# EAGLE design Shield (EAGLE 7.5.0)
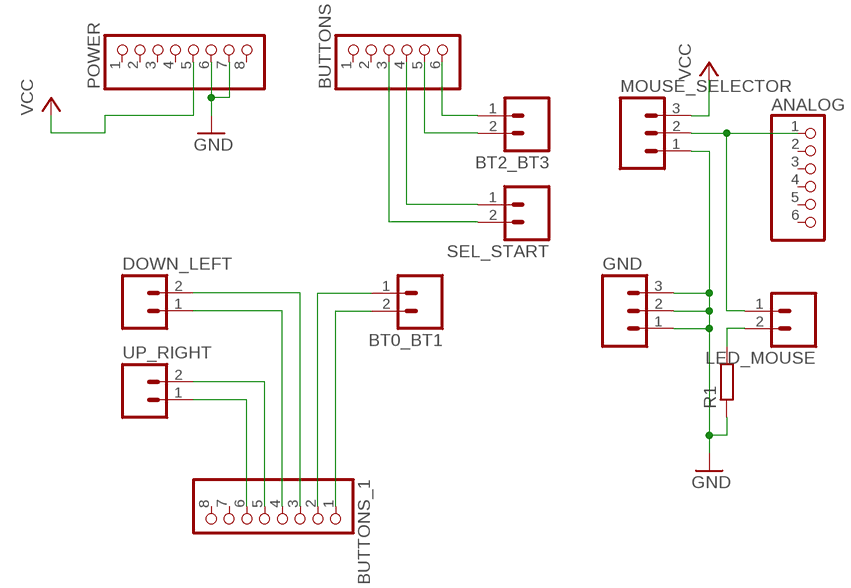
[diagram p0: schematic, sheet 1]

## Parts
ANALOG  PINHD-1X6  [1X06]
BT0_BT1  M023.5MM  [SCREWTERMINAL-3.5MM-2]
BT2_BT3  M023.5MM  [SCREWTERMINAL-3.5MM-2]
BUTTONS  PINHD-1X6  [1X06]
BUTTONS_1  PINHD-1X8BIG  [1X08-BIG]
DOWN_LEFT  M023.5MM  [SCREWTERMINAL-3.5MM-2]
GND  M03SCREW  [SCREWTERMINAL-3.5MM-3]
LED_MOUSE  M023.5MM  [SCREWTERMINAL-3.5MM-2]
MOUSE_SELECTOR  M03SCREW  [SCREWTERMINAL-3.5MM-3]
POWER  PINHD-1X8BIG  [1X08-BIG]
R1  R-EU_0204/7  [0204/7]
SEL_START  M023.5MM  [SCREWTERMINAL-3.5MM-2]
UP_RIGHT  M023.5MM  [SCREWTERMINAL-3.5MM-2]

## Nets
GND: GND.1 GND.2 GND.3 MOUSE_SELECTOR.1 POWER.6 POWER.7 R1.1
N$1: BT0_BT1.2 BUTTONS_1.1
N$2: BT0_BT1.1 BUTTONS_1.2
N$3: BUTTONS_1.3 DOWN_LEFT.2
N$4: BUTTONS_1.4 DOWN_LEFT.1
N$5: BUTTONS_1.5 UP_RIGHT.2
N$6: BUTTONS_1.6 UP_RIGHT.1
N$7: BT2_BT3.1 BUTTONS.6
N$8: BT2_BT3.2 BUTTONS.5
N$9: BUTTONS.4 SEL_START.1
N$10: BUTTONS.3 SEL_START.2
N$12: ANALOG.1 LED_MOUSE.1 MOUSE_SELECTOR.2
N$13: LED_MOUSE.2 R1.2
VCC: MOUSE_SELECTOR.3 POWER.5
Unconnected: ANALOG.2 ANALOG.3 ANALOG.4 ANALOG.5 ANALOG.6 BUTTONS.1 BUTTONS.2 BUTTONS_1.7 BUTTONS_1.8 POWER.1 POWER.2 POWER.3 POWER.4 POWER.8

## Library data of the parts
ANALOG BUTTONS = adafruit:PINHD-1X6: PIN HEADER
BT0_BT1 BT2_BT3 DOWN_LEFT LED_MOUSE SEL_START UP_RIGHT = SparkFun-Connectors:M02: Standard 2-pin 0.1" header. Use with - straight break away headers ( PRT-00116) - right angle break away headers (PRT-00553) - swiss pins (PRT-00743) - machine pins (PRT-00117) - female headers (PRT-00115) Molex polarized connector foot print use with: PRT-08233 with associated crimp pins and housings. 2.54_SCREWTERM for use with PRT-10571. 3.5mm Screw Terminal footprints for PRT-08084 5mm Screw Terminal footprints for use with PRT-08432; PROD_ID: CONN-08399
BUTTONS_1 POWER = adafruit:PINHD-1X8: PIN HEADER
GND MOUSE_SELECTOR = SparkFun-Connectors:M03: Header 3 Standard 3-pin 0.1" header. Use with straight break away headers (SKU : PRT-00116), right angle break away headers (PRT-00553), swiss pins (PRT-00743), machine pins (PRT-00117), and female headers (PRT-00115). Molex polarized connector foot print use with SKU : PRT-08232 with associated crimp pins and housings.; PROD_ID: CONN-08288
R1 = rcl:R-EU_: RESISTOR, European symbol

## Board
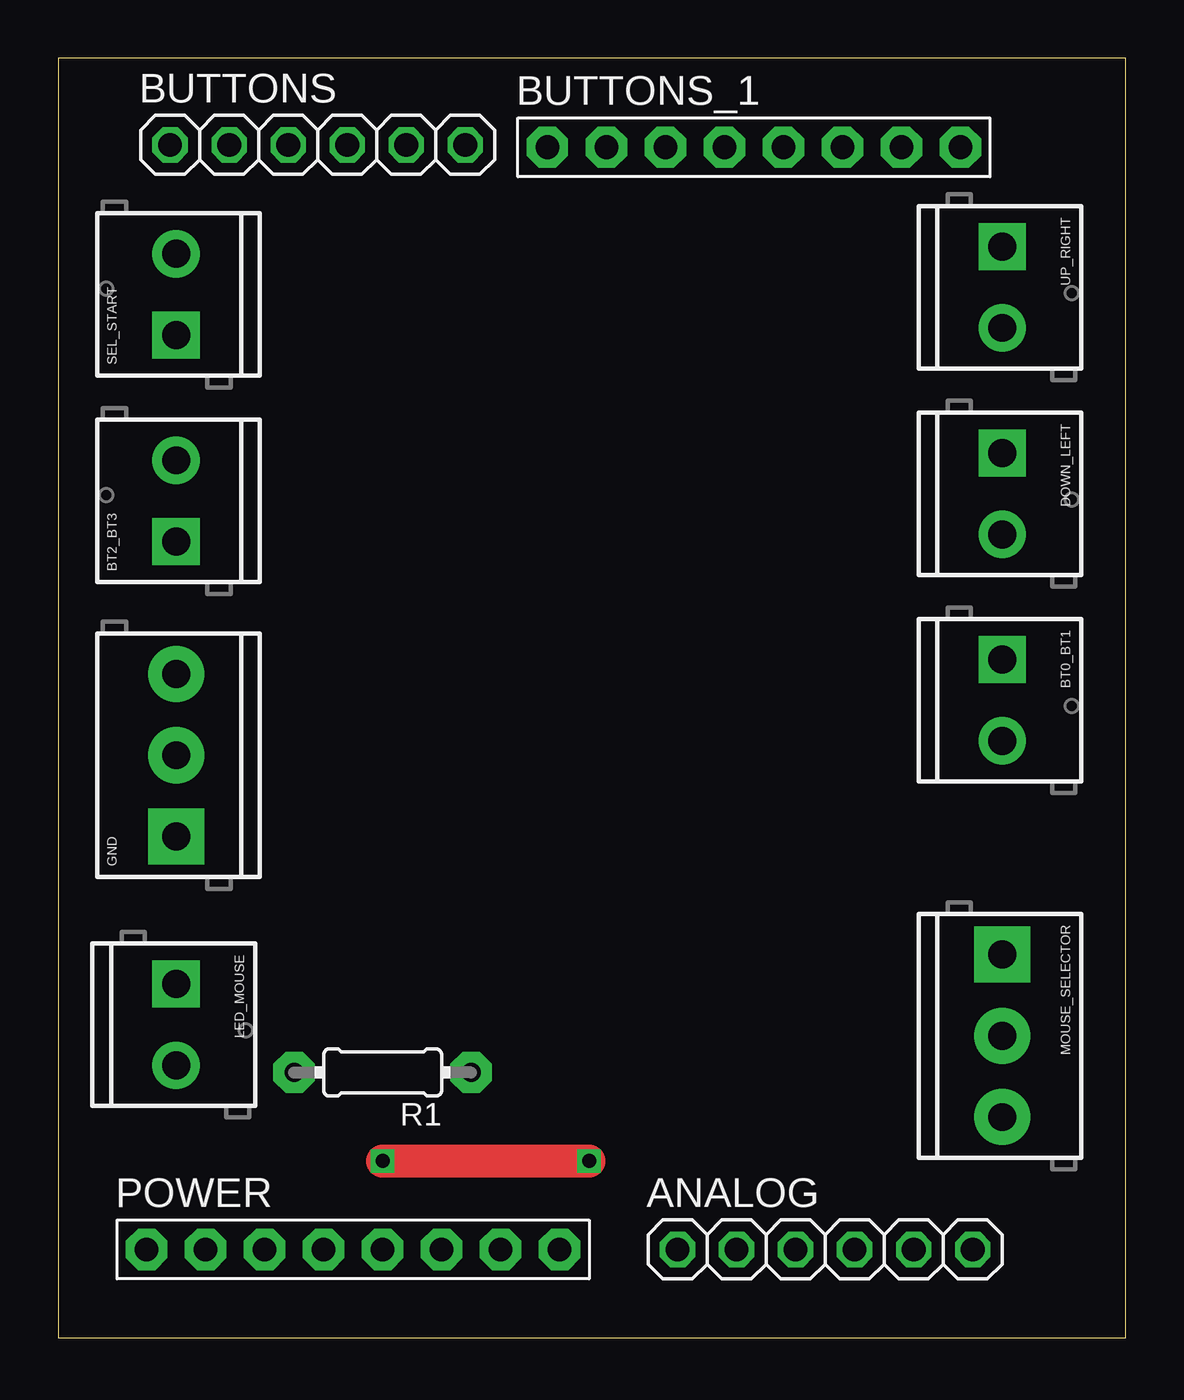
[diagram p1: board, top side]
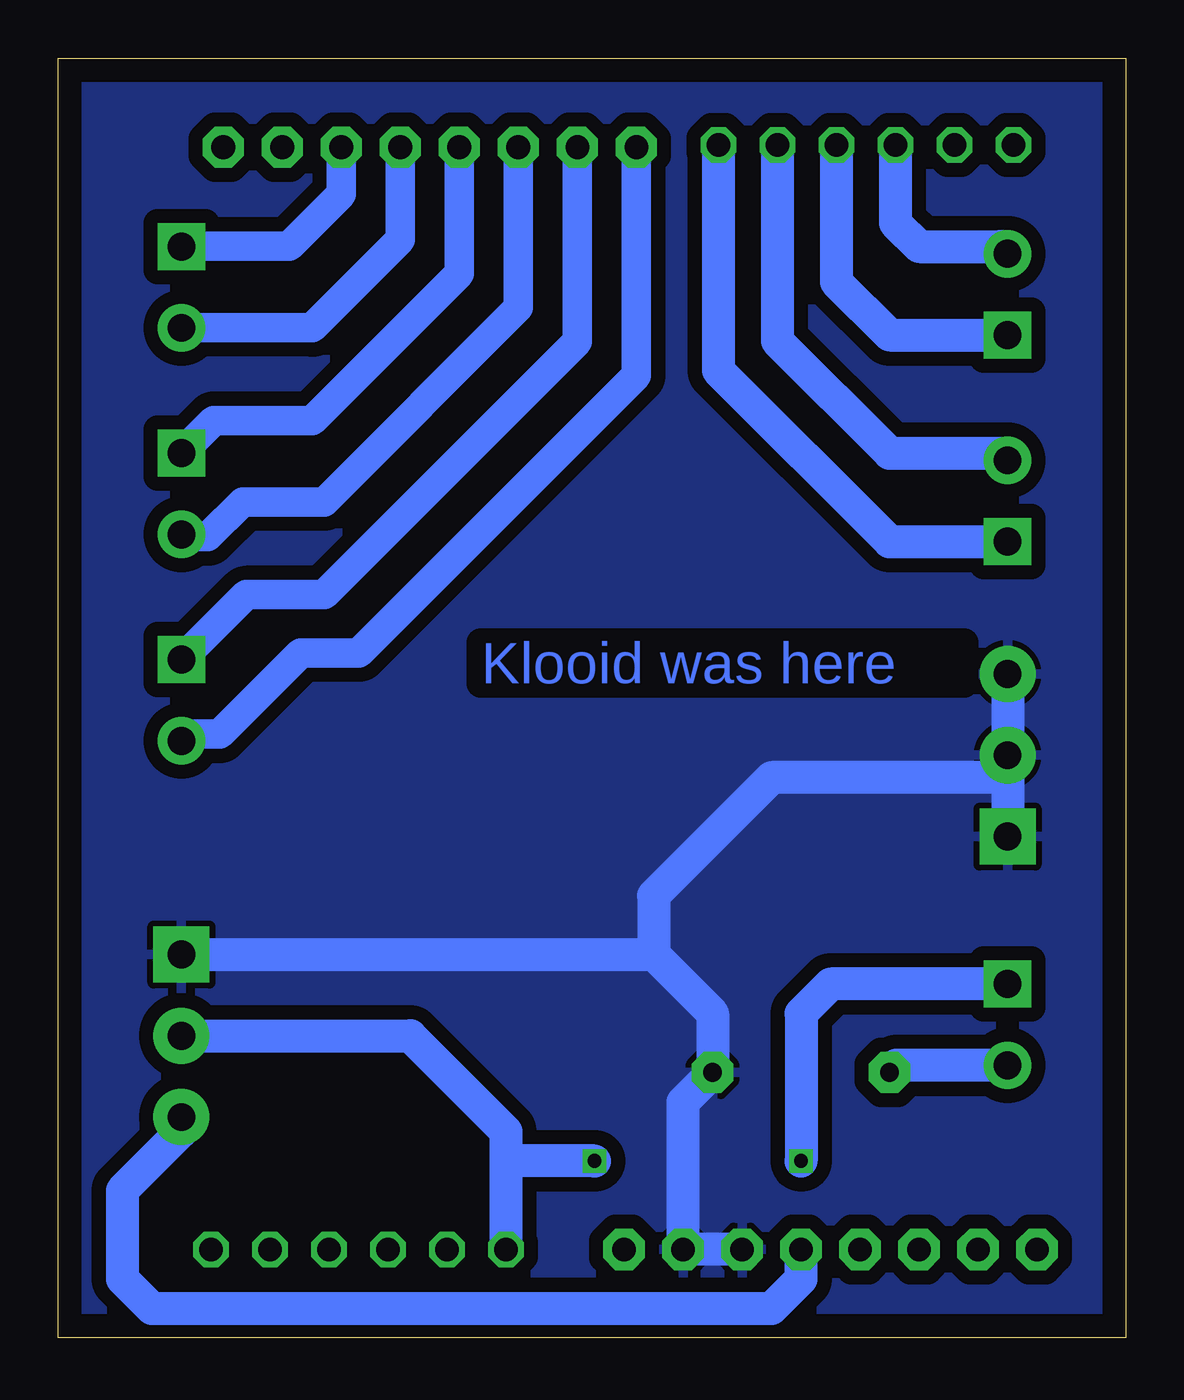
[diagram p2: board, bottom side, seen from below]

Size 45.95 x 55.11 mm. Coordinates in mm from the lower left corner, seen from the top.
Outline: 0,0 45.95,0 45.95,55.11 0,55.11 0,0
Copper layers (1*16): Top 0.035mm / dielectric 1.5mm / Bottom 0.035mm
Design rules "default": minimum track width 10mil, minimum drill 24mil, track to track 8mil, track to pad 8mil, pad to pad 8mil, via to via 8mil, smd to smd 8mil, copper to edge 40mil, drill to drill 8mil, minimum pad ring 10mil, minimum via ring 8mil, stop-mask expansion 4mil, vias tented up to drill 0mil, thermal gap 10mil

### Footprints (pad centres in the part's own frame; a part is rotated, then mirrored left to right if it is on the bottom)
1X06 = drill 1.016 octagon: 1 -6.35,0; 2 -3.81,0; 3 -1.27,0; 4 1.27,0; 5 3.81,0; 6 6.35,0
SCREWTERMINAL-3.5MM-2 = drill 1.2 pad 2.032 square: 1 0,0 | drill 1.2 pad 2.032: 2 3.5,0
1X08-BIG = drill 1.016 pad 1.778 octagon: 1 -8.89,0; 2 -6.35,0; 3 -3.81,0; 4 -1.27,0; 5 1.27,0; 6 3.81,0; 7 6.35,0; 8 8.89,0
SCREWTERMINAL-3.5MM-3 = drill 1.2 pad 2.413 square: 1 0,0 | drill 1.2 pad 2.413: 2 3.5,0; 3 7,0
0204/7 = drill 0.813 pad 1.778 octagon: 1 -3.81,0; 2 3.81,0

### Placement (x,y rotation side)
ANALOG  33.02,3.81 0 top
BT0_BT1  40.64,29.21 270 top
BT2_BT3  5.08,34.29 90 top
BUTTONS  11.18,51.37 0 top
BUTTONS_1  29.95,51.27 0 top
DOWN_LEFT  40.64,38.1 270 top
GND  5.08,21.59 90 top
LED_MOUSE  5.08,15.24 270 top
MOUSE_SELECTOR  40.64,16.51 270 top
POWER  12.7,3.81 0 top
R1  13.97,11.43 180 top
SEL_START  5.08,43.18 90 top
UP_RIGHT  40.64,46.99 270 top

### Tracks (layer width: path | path; a pad name or v marks a point on that pad's centre or on a via)
GND
  Bottom 1.422: POWER.6 POWER.7 19.05,10.16 R1.1 17.78,13.97 20.32,16.51 | MOUSE_SELECTOR.1 20.32,16.51 | 5.08,24.13 GND.2 GND.3 | 5.08,24.13 GND.1 | 5.08,24.13 15.24,24.13 20.32,19.05 20.32,16.51
  pour Bottom (isolate 0.61): 0,54.93 45.82,54.93 45.82,0 0,0
N$1
  Bottom 1.27: BUTTONS_1.1 21.06,41.44 33,29.5 35.5,29.5 39,26 40.35,26 BT0_BT1.2
N$2
  Bottom 1.27: BUTTONS_1.2 23.6,42.9 34.5,32 37.85,32 BT0_BT1.1
N$3
  Bottom 1.27: BUTTONS_1.3 26.14,44.36 34.5,36 38,36 39.5,34.5 40.54,34.5 DOWN_LEFT.2
N$4
  Bottom 1.27: BUTTONS_1.4 28.68,45.82 35,39.5 39.24,39.5 DOWN_LEFT.1
N$5
  Bottom 1.27: BUTTONS_1.5 31.22,47.28 35,43.5 UP_RIGHT.2
N$6
  Bottom 1.27: BUTTONS_1.6 33.76,49.24 36,47 UP_RIGHT.1
N$7
  Bottom 1.422: BUTTONS.6 17.53,41.66 10.16,34.29 BT2_BT3.1
N$8
  Bottom 1.422: BUTTONS.5 14.99,42.93 10.16,38.1 5.39,38.1 BT2_BT3.2
N$9
  Bottom 1.422: BUTTONS.4 12.45,45.47 10.16,43.18 SEL_START.1
N$10
  Bottom 1.422: BUTTONS.3 9.91,48.01 8.89,46.99 5.39,46.99 SEL_START.2
N$12  (via drill 0.6)
  Top 1.422: v13.97,7.62 v22.86,7.62
  Bottom 1.422: MOUSE_SELECTOR.2 30.79,13.01 26.67,8.89 26.67,7.62 | 26.67,7.62 ANALOG.1 | LED_MOUSE.1 12.7,15.24 13.97,13.97 v13.97,7.62 | v22.86,7.62 26.67,7.62
N$13
  Bottom 1.422: LED_MOUSE.2 9.85,11.74 R1.2
VCC
  Bottom 1.422: MOUSE_SELECTOR.3 40.64,8.89 43.18,6.35 43.18,2.54 41.91,1.27 15.24,1.27 13.97,2.54 POWER.5

### Text on the board
Bottom: Klooid was here